# EAGLE design main (EAGLE 9.3.0)
COMPANY_NAME: Experimental Avionics; PROJ_TITLE: Servo Controller; REVISION: Rev 2
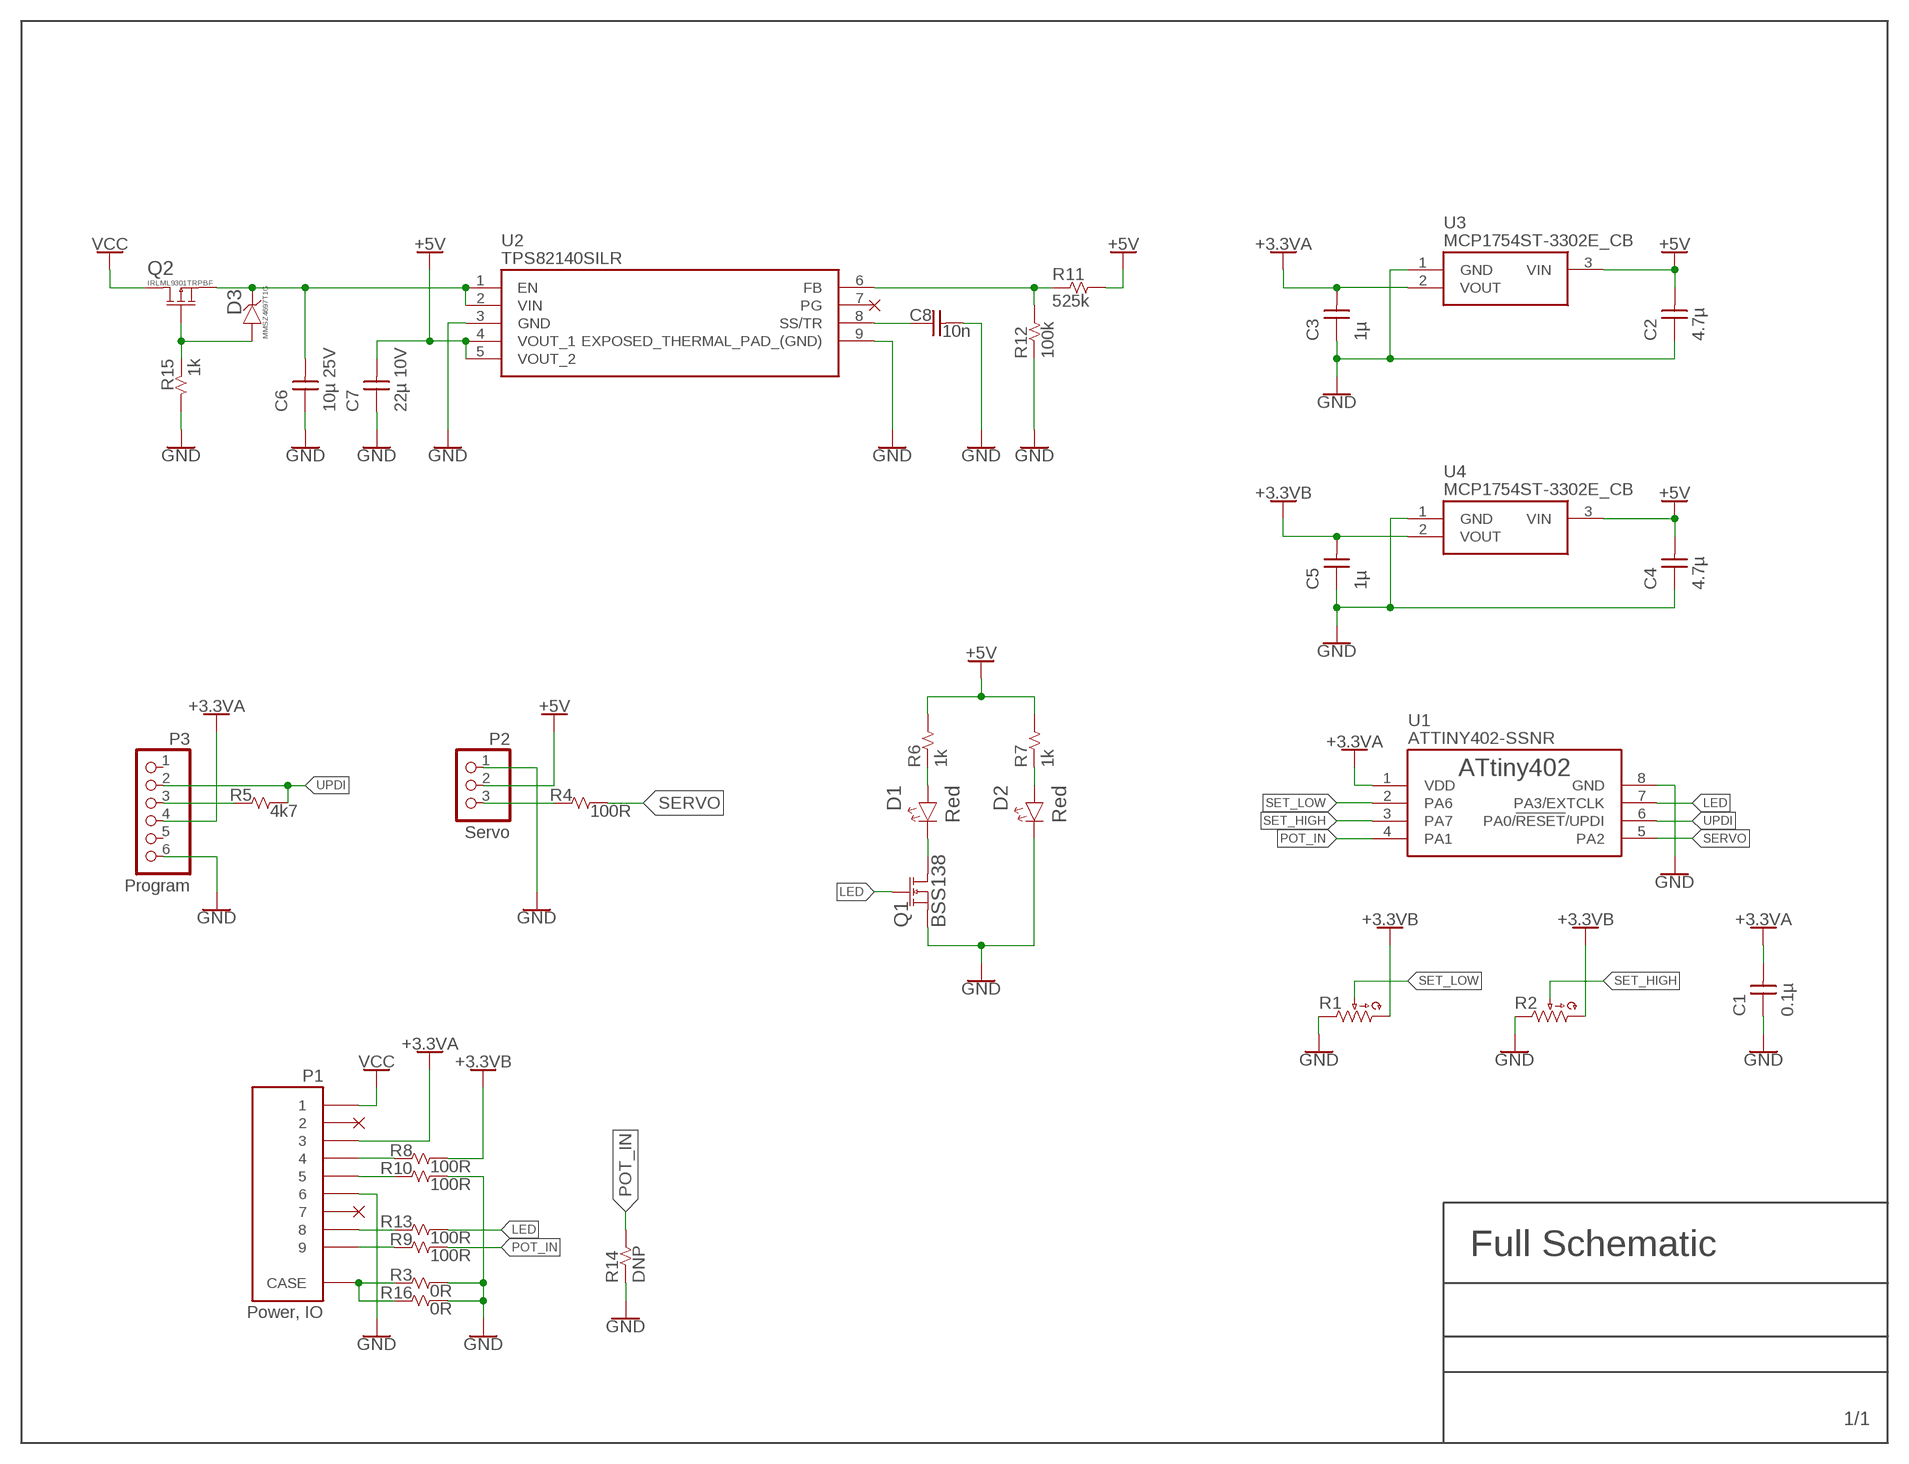
[diagram p0: schematic, sheet 1]
U$1 (LETTER-HORIZONTAL): SCH_NAME: Full Schematic

## Parts
C1  0.1µ  CAPACITOR-0603  [CAPC1608X90]
C2  4.7µ  CAPACITOR-0805  [CAPC2012X90]
C3  1µ  CAPACITOR-0805  [CAPC2012X90]
C4  4.7µ  CAPACITOR-0805  [CAPC2012X90]
C5  1µ  CAPACITOR-0805  [CAPC2012X90]
C6  10µ 25V  CAPACITOR-1206  [CAPC3216X180]
C7  22µ 10V  CAPACITOR-0805  [CAPC2012X90]
C8  10n  CAPACITOR-0603  [CAPC1608X90]
D1  Red  LED-DIALIGHT-1206  [SODFL3216X68]
D2  Red  LED-DIALIGHT-1206  [SODFL3216X68]
D3  MMSZ4697T1G  DIODE-ZENER-SOD-123F  [SODFL3518X115]
P1  Power, IO  DB9  [D09P24A4GV00LF]
P2  Servo  PINHD-1X3/90  [1X03/90]
P3  Program  PINHD-1X6  [1X06]
Q1  BSS138  [SOT95P240X110-3]
Q2  IRLML9301TRPBF  [SOT95P240X110-3]
R1  POTENTIOMETER  [TT_23B]
R2  POTENTIOMETER  [TT_23B]
R3  0R  RESISTOR-0603  [RESC1608X55]
R4  100R  RESISTOR-0603  [RESC1608X55]
R5  4k7  RESISTOR-0603  [RESC1608X55]
R6  1k  RESISTOR-0603  [RESC1608X55]
R7  1k  RESISTOR-0603  [RESC1608X55]
R8  100R  RESISTOR-0603  [RESC1608X55]
R9  100R  RESISTOR-0603  [RESC1608X55]
R10  100R  RESISTOR-0603  [RESC1608X55]
R11  525k  RESISTOR-0603  [RESC1608X55]
R12  100k  RESISTOR-0603  [RESC1608X55]
R13  100R  RESISTOR-0603  [RESC1608X55]
R14  DNP  RESISTOR-0603  [RESC1608X55]
R15  1k  RESISTOR-0603  [RESC1608X55]
R16  0R  RESISTOR-0603  [RESC1608X55]
U1  ATTINY402-SSNR  [SOIC127P599X175-8]
U2  TPS82140SILR  [SIL0008D]
U3  MCP1754ST-3302E_CB  [SOT95P255X145-3N]
U4  MCP1754ST-3302E_CB  [SOT95P255X145-3N]

## Nets
+3V3A: C1.2 C3.2 P1.P$3 P3.4 U1.1(VDD) U3.2(VOUT)
+3V3B: C5.2 R1.P$3 R2.P$3 R8.2 U4.2(VOUT)
+5V: C2.2 C4.2 C7.2 P2.2 R6.2 R7.2 R11.2 U2.4(VOUT_1) U2.5(VOUT_2) U3.3(VIN) U4.3(VIN)
GND: C1.1 C2.1 C3.1 C4.1 C5.1 C6.1 C7.1 C8.2 D2.1(C) P1.P$6 P2.1 P3.6 Q1.2(S) R1.P$1 R2.P$1 R3.2 R10.2 R12.1 R14.1 R15.2 R16.2 U1.8(GND) U2.3(GND) U2.9(EXPOSED_THERMAL_PAD_(GND)) U3.1(GND) U4.1(GND)
LED: Q1.1(G) R13.2 U1.7(PA3/EXTCLK)
N$1: P3.3 R5.1
N$2: C8.1 U2.8(SS/TR)
N$3: P1.P$10(CASE) P1.P$11(CASE) R3.1 R16.1
N$4: D1.2(A) R6.1
N$5: R11.1 R12.2 U2.6(FB)
N$6: P1.P$9 R9.1
N$7: P1.P$5 R10.1
N$8: D2.2(A) R7.1
N$9: D1.1(C) Q1.3(D)
N$10: P2.3 R4.1
N$11: P1.P$4 R8.1
N$12: P1.P$8 R13.1
N$14: D3.2(A) Q2.1(G) R15.1
N$15: C6.2 D3.1(C) Q2.2(S) U2.1(EN) U2.2(VIN)
POT_IN: R9.2 R14.2 U1.4(PA1)
SERVO: R4.2 U1.5(PA2)
SET_HIGH: R2.P$2 U1.3(PA7)
SET_LOW: R1.P$2 U1.2(PA6)
UPDI: P3.2 R5.2 U1.6(PA0/!RESET!/UPDI)
VCC: P1.P$1 Q2.3(D)
Unconnected: P1.P$2 P1.P$7 P3.1 P3.5 U2.7(PG)

## Library data of the parts
C1-C8 = lcr:CAPACITOR
D1 D2 = lcr:LED
D3 = lcr:DIODE-ZENER
P1 = connectors:DB9
P2 = pinhead:PINHD-1X3: PIN HEADER
P3 = pinhead:PINHD-1X6: PIN HEADER
Q1 = transistors:BSS138
Q2 = transistors:IRLML9301
R1 R2 = lcr:POTENTIOMETER
R3-R16 = lcr:RESISTOR
U1 = microchip-processors:ATTINY402: The ATtiny202/402 microcontrollers are using the high-performance, low-power AVR® RISC architecture, and are capable of running at up to 20 MHz, with up to 2/4 KB Flash, 128/256 bytes of SRAM, and 64/128 bytes of EEPROM in a 8-pin package. The series uses the latest technologies with a flexible and low-power architecture including Event System and SleepWalking, accurate analog features, and advanced peripherals.; TEMP-RANGE: -40ºC to +105ºC
U2 = imported:TPS82140SILR: Non-Isolated DC/DC Converters 17V Input 2A Synchronous Step-Down Converter Module With Integrated MicroSiP 8-uSiP -40 to 125 Source: Datasheet <http://www.ti.com/lit/ds/symlink/tps82140.pdf>; DESCRIPTION: Non-Isolated DC/DC Converters 17V Input 2A Synchronous Step-Down Converter Module With Integrated MicroSiP 8-uSiP -40 to 125; HEIGHT: mm; MANUFACTURER_NAME: Texas Instruments; MANUFACTURER_PART_NUMBER: TPS82140SILR; MOUSER_PART_NUMBER: 595-TPS82140SILR; MOUSER_PRICE-STOCK: https://www.mouser.com/Search/Refine.aspx?Keyword=595-TPS82140SILR
U3 U4 = imported:MCP1754ST-3302E_CB: LDO regulator,voltage,3.3V,150mA,SOT23A Microchip MCP1754ST-3302E/CB, Single Linear Voltage Regulator, 150mA 3.3 V, 2%, 3-Pin SOT-23A Source: Datasheet <http://docs-emea.rs-online.com/webdocs/1345/0900766b8134501b.pdf>; ALLIED_NUMBER: 70414903; ALLIED_PRICE-STOCK: http://www.alliedelec.com/microchip-technology-inc-mcp1754st-3302e-cb/70414903/; DESCRIPTION: LDO regulator,voltage,3.3V,150mA,SOT23A Microchip MCP1754ST-3302E/CB, Single Linear Voltage Regulator, 150mA 3.3 V, 2%, 3-Pin SOT-23A; HEIGHT: 1.45mm; MANUFACTURER_NAME: Microchip; MANUFACTURER_PART_NUMBER: MCP1754ST-3302E/CB; MOUSER_PART_NUMBER: 579-MCP1754T-3302ECB; MOUSER_PRICE-STOCK: https://www.mouser.com/Search/Refine.aspx?Keyword=579-MCP1754T-3302ECB; RS_PART_NUMBER: 7559521P; RS_PRICE-STOCK: http://uk.rs-online.com/web/p/products/7559521P

## Board
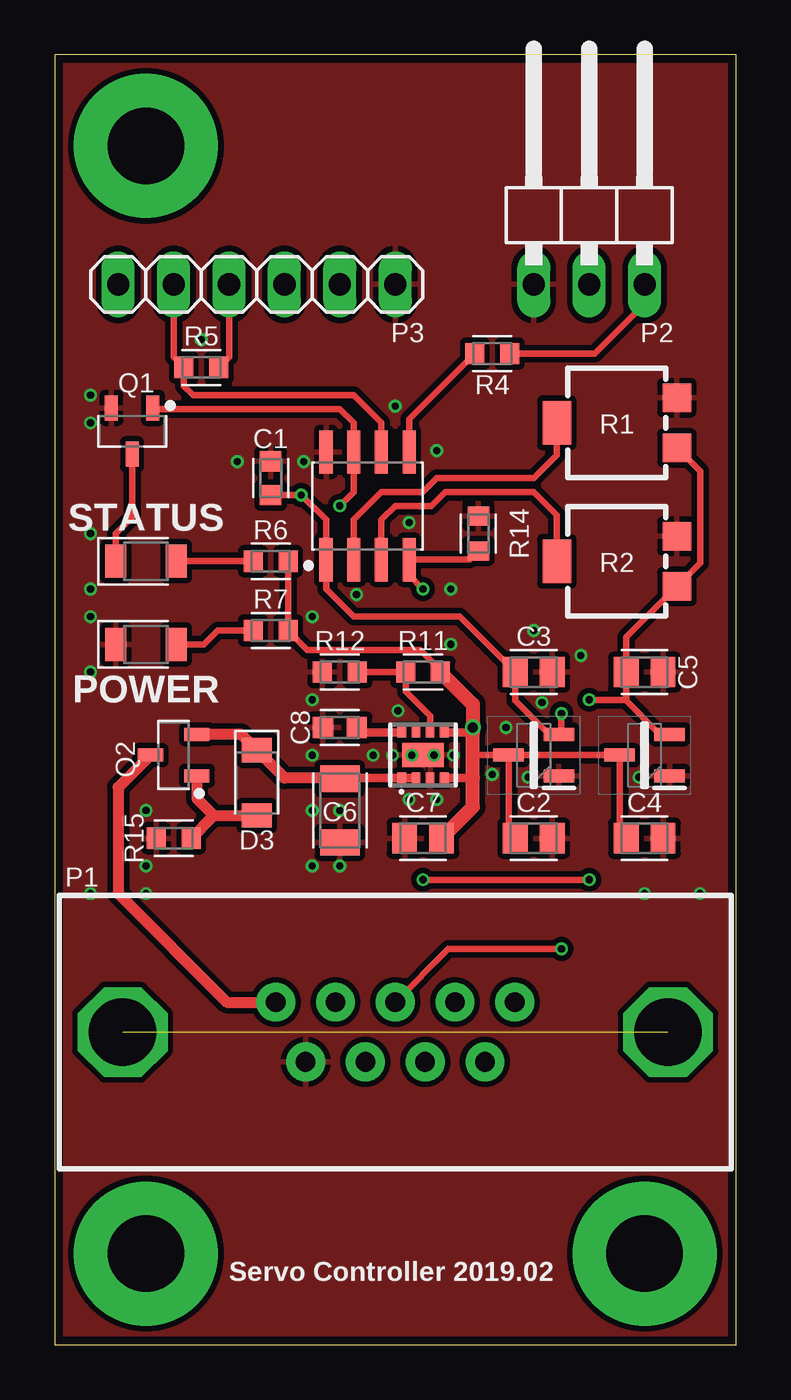
[diagram p1: board, top side]
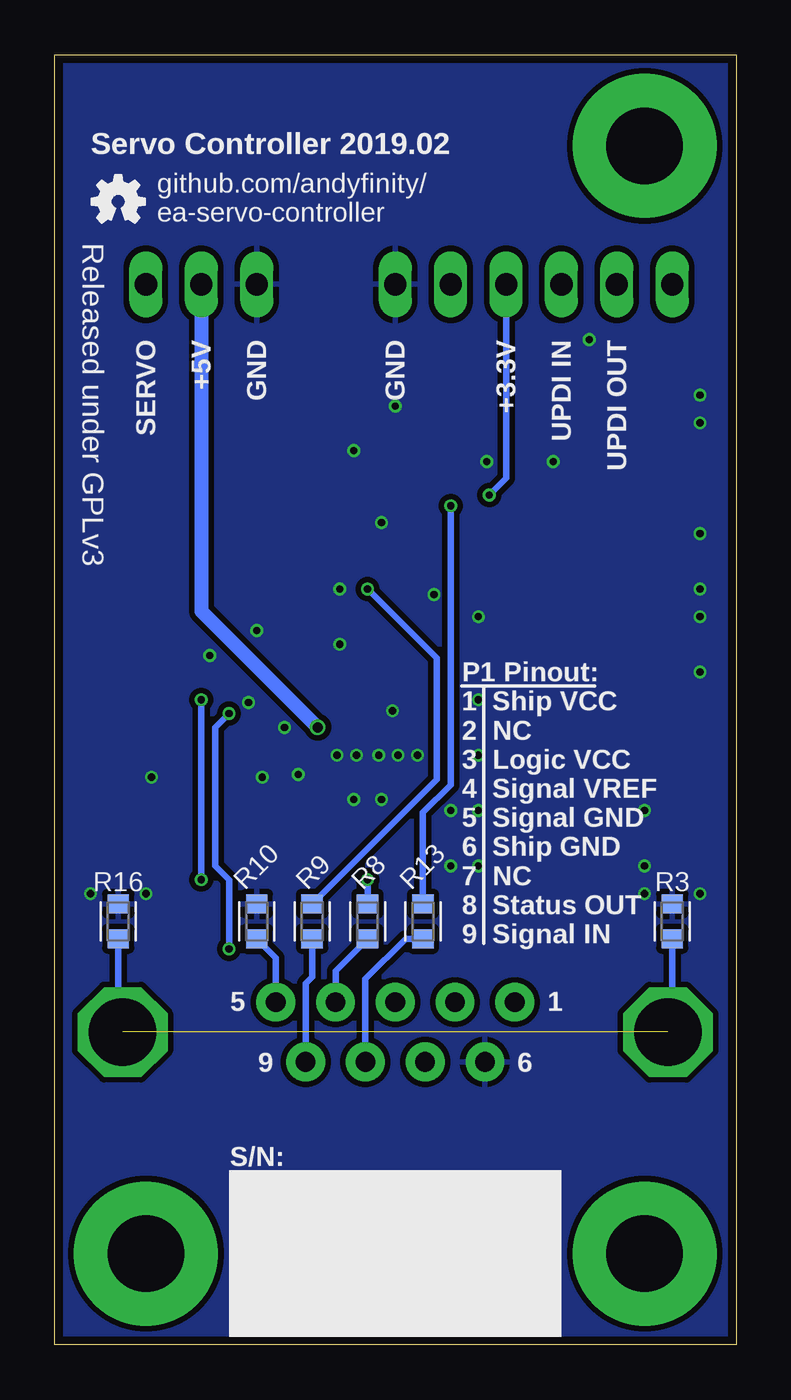
[diagram p2: board, bottom side, seen from below]

Size 31.24 x 59.18 mm. Coordinates in mm from the lower left corner, seen from the top.
Outline: 0,0 31.24,0 31.24,59.18 0,59.18 0,0
Copper layers (1*16): Top 0.035559375mm / dielectric 1.6mm / Bottom 0.035559375mm
Design rules "oshpark-2layer-tented": minimum track width 6mil, minimum drill 10mil, track to track 6mil, track to pad 6mil, pad to pad 6mil, via to via 6mil, smd to smd 6mil, copper to edge 15mil, drill to drill 6mil, minimum pad ring 5mil, minimum via ring 5mil, stop-mask expansion 2.5mil, vias tented up to drill 20mil, thermal gap 10mil

### Footprints (pad centres in the part's own frame; a part is rotated, then mirrored left to right if it is on the bottom)
CAPC1608X90 = smd 0.921 x 0.98: 1 -0.775,0; 2 0.775,0
CAPC2012X90 = smd 1.136 x 1.379: 1 -0.847,0; 2 0.847,0
CAPC3216X180 = smd 1.196 x 1.815: 1 -1.46,0; 2 1.46,0
SODFL3216X68 = smd 0.96 x 1.512: 1 -1.385,0; 2 1.385,0
SODFL3518X115 = smd 1.115 x 1.361: 1 -1.5,0; 2 1.5,0
D09P24A4GV00LF = drill 0.9 pad 1.778: P$1 -5.48,1.37; P$2 -2.74,1.37; P$3 0,1.37; P$4 2.74,1.37; P$5 5.48,1.37; P$6 -4.11,-1.37; P$7 -1.37,-1.37; P$8 1.37,-1.37; P$9 4.11,-1.37 | drill 3.1 octagon: P$10 -12.5,0; P$11 12.5,0
1X03/90 = drill 1.016 long: 1 -2.54,-3.81; 2 0,-3.81; 3 2.54,-3.81
1X06 = drill 1.016 long: 1 -6.35,0; 2 -3.81,0; 3 -1.27,0; 4 1.27,0; 5 3.81,0; 6 6.35,0
SOT95P240X110-3 = smd 1.149 x 0.597: 1 -1.061,0.95; 2 -1.061,-0.95; 3 1.061,0
TT_23B = smd 1.3 x 1.3: P$1 2.75,1.15; P$3 2.75,-1.15 | smd 1.3 x 2: P$2 -2.75,0
RESC1608X55 = smd 0.871 x 0.979: 1 -0.8,0; 2 0.8,0
SOIC127P599X175-8 = smd 1.972 x 0.599: 1 -2.472,1.905; 2 -2.472,0.635; 3 -2.472,-0.635; 4 -2.472,-1.905; 5 2.472,-1.905; 6 2.472,-0.635; 7 2.472,0.635; 8 2.472,1.905
SIL0008D = smd 0.5 x 0.4: 1 -1.05,0.975; 2 -1.05,0.325; 3 -1.05,-0.325; 4 -1.05,-0.975; 5 1.05,-0.975; 6 1.05,-0.325; 7 1.05,0.325; 8 1.05,0.975 | smd 1.1 x 1.9: 9 0,0
SOT95P255X145-3N = smd 1.4 x 0.6: 1 -1.15,0.95; 2 -1.15,-0.95; 3 1.15,0

### Placement (x,y rotation side)
C1  9.91,39.75 270 top
C2  21.97,23.24 180 top
C3  21.97,30.86 180 top
C4  27.05,23.24 180 top
C5  27.05,30.86 180 top
C6  13.08,24.51 90 top
C7  16.89,23.24 0 top
C8  13.08,28.32 180 top
D1  4.19,35.94 0 top
D2  4.19,32.13 0 top
D3  9.27,25.78 270 top
P1  15.62,14.35 0 top
P2  24.51,52.45 0 top
P3  9.27,48.64 0 top
Q1  3.56,41.91 270 top
Q2  5.46,27.05 180 top
R1  25.78,42.29 0 top
R2  25.78,35.94 0 top
R3  2.92,19.43 90 bottom
R4  20.07,45.47 180 top
R5  6.73,44.83 180 top
R6  9.91,35.94 0 top
R7  9.91,32.77 0 top
R8  16.89,19.43 90 bottom
R9  19.43,19.43 90 bottom
R10  21.97,19.43 90 bottom
R11  16.89,30.86 0 top
R12  13.08,30.86 0 top
R13  14.35,19.43 90 bottom
R14  19.43,37.21 270 top
R15  5.46,23.24 180 top
R16  28.32,19.43 90 bottom
U1  14.35,38.48 90 top
U2  16.89,27.05 90 top
U3  21.97,27.05 180 top
U4  27.05,27.05 180 top
U$2  [OSHW-LOGO-MINI]  28.32,52.45 0 bottom

### Tracks (layer width: path | path; a pad name or v marks a point on that pad's centre or on a via)
+3V3A  (via drill 0.33)
  Top 0.305: P1.P$3 18.06,18.16 v23.24,18.16 | v23.24,28.96 23.24,28.12 U3.2 23.05,28.07 22.61,28.07 21.12,29.55 C3.2 18.59,33.4 13.72,33.4 12.45,34.67 U1.1 12.45,37.85 v11.32,38.98 C1.2
  Bottom 0.305: v23.24,28.96 23.88,28.32 23.88,21.97 23.24,21.34 v23.24,18.16 | P3.4 10.54,39.75 v11.32,38.98
+3V3B  (via drill 0.33)
  Top 0.305: R1.P$3 29.59,40.08 29.59,35.85 R2.P$3 26.2,32.46 C5.2 26.2,29.55 | 26.2,29.55 27.69,28.07 28.14,28.07 U4.2 | v16.89,21.34 v24.51,21.34 | v24.51,29.59 26.16,29.59 26.2,29.55
  Bottom 0.305: R8.2 v16.89,21.34 | v24.51,21.34 v24.51,29.59
+5V  (via drill 0.46)
  Top 0.305: C4.2 25.9,23.55 U4.3 U3.3 | U3.3 20.82,23.55 C2.2 | R6.2 R7.2 11.6,31.88 16.76,31.88 17.69,30.95 R11.2 | U3.3 19.18,27.05
  Top 0.381: U2.4 19.18,26 | U2.5 19.18,28.1
  Top 0.635: R11.2 19.18,29.38 v19.18,28.32 | C7.2 19.18,24.68 19.18,26 19.18,27.05 v19.18,28.32 | 19.18,28.1 v19.18,28.32
  Bottom 0.635: P2.2 24.51,33.66 v19.18,28.32
GND  (via drill 0.33)
  other vias: 15.49,27.05 14.61,27.05 18.29,27.05 11.81,24.51 4.19,24.51 4.19,21.97 4.19,20.7 1.65,20.7 1.65,30.86 1.65,33.4 1.65,34.67 1.65,37.21 1.65,43.56 1.65,42.29 8.38,40.51 21.72,26.03 26.8,26.03 27.05,20.7 29.59,20.7 20.7,28.32 18.16,32.13 11.81,33.4 18.16,34.67 16.26,37.72 22.35,29.46 13.08,24.51 16.38,27.05 17.4,27.05 21.97,32.77 24.13,31.62 17.53,41.02 11.43,40.51 15.62,43.05 6.73,46.1 13.84,34.42 11.81,29.59 11.81,27.05 11.81,21.97 13.08,21.97 17.53,25.02 16.26,25.02 15.75,29.08 20.07,26.16
  pour Bottom (isolate 0.254): 0,59.18 0,0 31.24,0 31.24,59.18
  pour Top (isolate 0.254): 0,59.18 0,0 31.24,0 31.24,59.18
LED  (via drill 0.33)
  Top 0.305: Q1.1 4.55,42.93 13.08,42.93 13.72,42.29 U1.7 13.72,39.12 v13.08,38.48
  Bottom 0.305: v13.08,38.48 13.08,25.69 14.35,24.42 R13.2
N$1
  Top 0.305: R5.1 8,45.3 P3.3
N$2
  Top 0.381: C8.1 14.08,28.1 U2.8
N$3  (1 unrouted)
  Bottom 0.305: R3.1 2.92,14.55 P1.P$10 | R16.1 28.32,14.55 P1.P$11
N$4
  Top 0.305: R6.1 D1.2
N$5
  Top 0.305: R12.2 R11.1 16.09,29.97 17.22,28.85 U2.6
N$6
  Bottom 0.305: R9.1 19.43,16.89 19.73,16.59 P1.P$9
N$7
  Bottom 0.305: R10.1 21.1,17.76 P1.P$5
N$8
  Top 0.305: R7.1 7.48,32.77 6.85,32.13 D2.2
N$9
  Top 0.305: Q1.3 3.56,37.96 2.81,37.21 D1.1
N$10
  Top 0.305: R4.1 24.77,45.47 27.05,47.75 P2.3
N$11
  Bottom 0.305: R8.1 18.36,17.16 P1.P$4
N$12
  Bottom 0.305: R13.1 15.15,18.63 16.99,16.79 P1.P$8
N$13  (via drill 3.5 pad 6.6)
  other vias: 4.19,4.19
N$14
  Top 0.508: R15.1 7.3,24.28 | Q2.1 6.52,25.06 6.9,24.68 | 6.9,24.68 7.3,24.28 | 6.9,24.68 7.3,24.28 | 7.3,24.28 D3.2
N$15
  Top 0.381: C6.2 13.11,26 U2.1 U2.2
  Top 0.508: 13.11,26 10.55,26 D3.1 8.55,28 Q2.2
N$16  (via drill 3.5 pad 6.6)
  other vias: 27.05,4.19
N$17  (via drill 3.5 pad 6.6)
  other vias: 4.19,54.99
POT_IN  (via drill 0.33)
  Top 0.305: R14.2 19.03,36.01 U1.4 16.26,35.31 v16.89,34.67
  Bottom 0.305: R9.2 13.72,25.95 13.72,31.5 v16.89,34.67
SERVO
  Top 0.305: U1.5 16.26,42.46 R4.2
SET_HIGH
  Top 0.305: U1.3 14.99,37.85 15.62,38.48 17.27,38.48 17.91,39.12 21.97,39.12 23.03,38.06 R2.P$2
SET_LOW
  Top 0.305: U1.2 13.72,37.85 14.99,39.12 16.89,39.12 17.53,39.75 21.97,39.75 23.03,40.81 R1.P$2
UPDI
  Top 0.305: P3.2 5.46,45.3 R5.2 5.93,43.98 6.35,43.56 13.72,43.56 14.99,42.29 U1.6
VCC
  Top 0.508: Q2.3 2.92,25.57 2.92,20.7 7.9,15.72 P1.P$1

### Text on the board
tPlace: STATUS | POWER | Servo Controller 2019.02
bPlace: Servo Controller 2019.02 | github.com/andyfinity/ / ea-servo-controller | Released under GPLv3 | UPDI OUT | UPDI IN | +3.3V | GND | GND | +5V | SERVO | P1 Pinout: / 1 Ship VCC / 2 NC / 3 Logic VCC / 4 Signal VREF / 5 Signal GND / 6 Ship GND / 7 NC / 8 Status OUT / 9 Signal IN | 1 | 5 | 6 | 9 | S/N:
tStop: ExperimentalAvionics
bStop: ExperimentalAvionics